# Altium project toetsenbord.PrjPcb
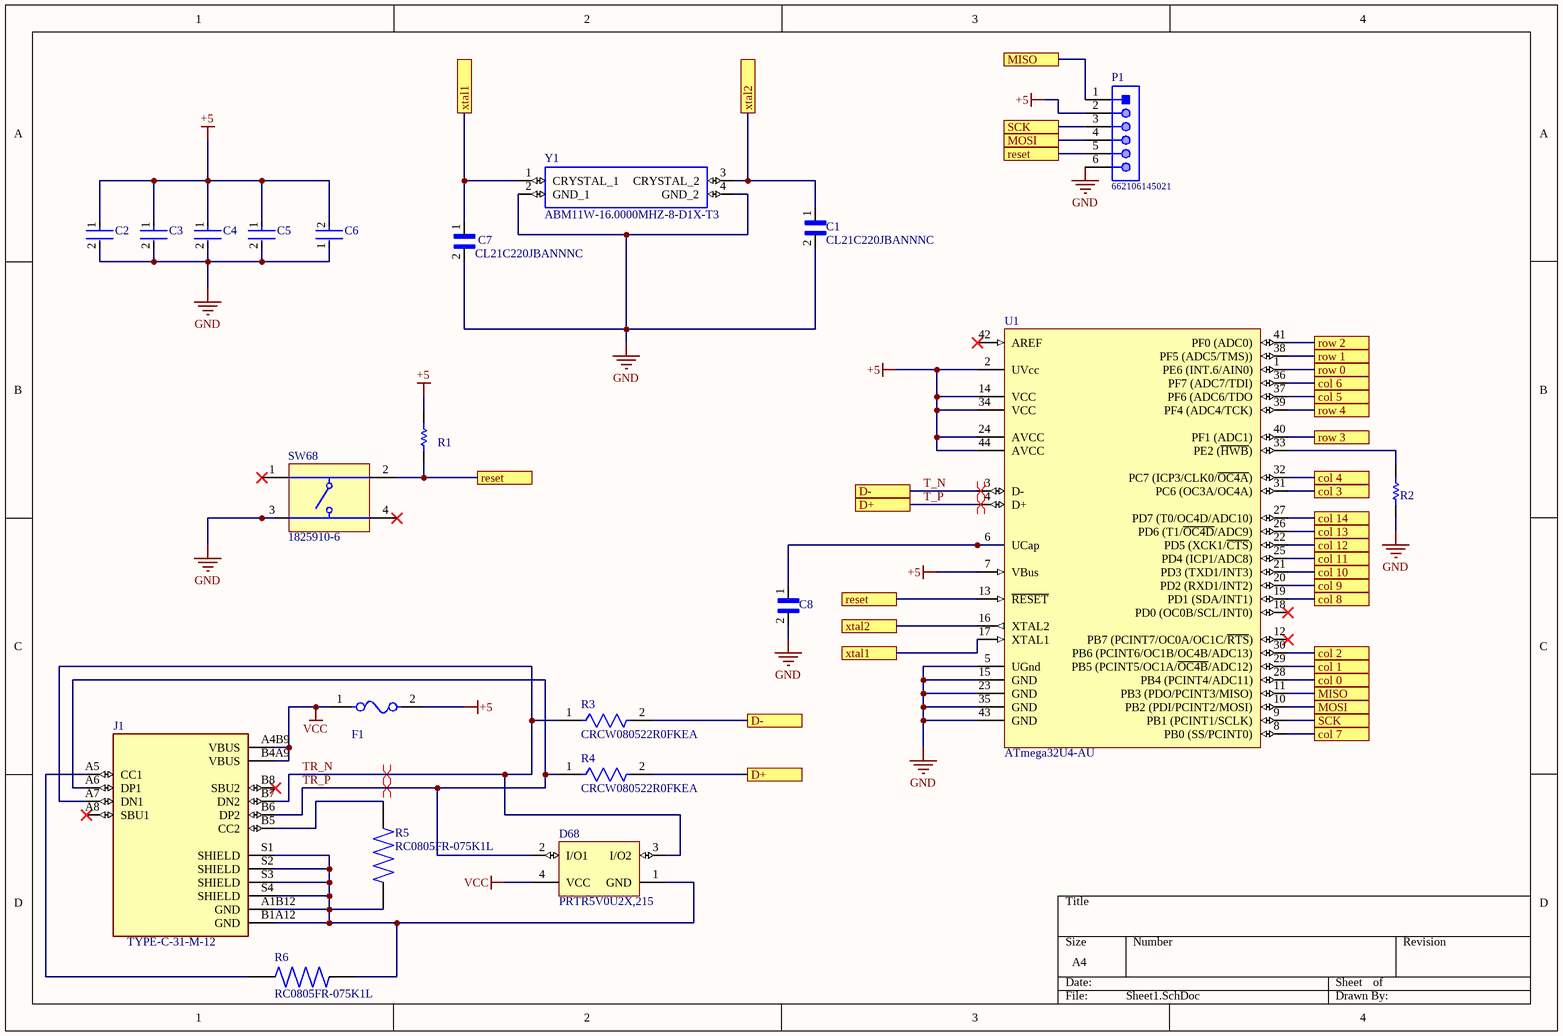
[diagram p0: Sheet1.SchDoc]
2 sheets, 155 parts. Net scope: flat (ports and power ports of the same name join across sheets).
Board file: PCB1.PcbDoc
Sheets:
  Sheet1.SchDoc
  switch matrix.SchDoc

## Sheet Sheet1.SchDoc
size A4; SheetNumber: 1; SheetTotal: 2

### Parts
C1  CL21C220JBANNNC  [CAPC2012X140N]
C2  (no value)  [FP-CL21-IPC_C]
C3  (no value)  [FP-CL21-IPC_C]
C4  (no value)  [FP-CL21-IPC_C]
C5  (no value)  [FP-CL21-IPC_C]
C6  (no value)  [FP-CL21B106KOQNNNE-MFG]
C7  CL21C220JBANNNC  [CAPC2012X140N]
C8  CL21B105KAFNNNE  [CAPC2012X140N]  (value not drawn)
D68  PRTR5V0U2X,215  [NXP-SOT143B-4_V]
F1  Fuse_Bel_0ZCJ0025AF2E_eec  [Bel_3216_0]  (value not drawn)
J1  TYPE-C-31-M-12  [HRO_TYPE-C-31-M-12]
P1  662106145021  [662106145021]
R1  RC0805FR-0710KL  [RESC2013X60X35NL10T20]  (value not drawn)
R2  RC0805FR-0710KL  [RESC2013X60X35NL10T20]  (value not drawn)
R3  CRCW080522R0FKEA  [FP-CRCW0805-e3-IPC_C]
R4  CRCW080522R0FKEA  [FP-CRCW0805-e3-IPC_C]
R5  RC0805FR-075K1L  [RESC2012X60N]
R6  RC0805FR-075K1L  [RESC2012X60N]
SW68  1825910-6  [TECO-1825910-6_V]
U1  ATmega32U4-AU  [44ML_M]
Y1  ABM11W-16.0000MHZ-8-D1X-T3  [ABM11W300000MHZ4B1UT3]

### Ports
col 0, col 1, col 2, col 3, col 4, col 5, col 6, col 7, col 8, col 9, col 10, col 11, col 12, col 13, col 14, D+, D-, MISO, MOSI, reset, row 0, row 1, row 2, row 3, row 4, SCK, xtal1, xtal2

### Nets
+5: C2.1 C3.1 C4.1 C5.1 C6.2 F1.2 P1.2 R1.2 U1.2(UVcc) U1.7(VBus) U1.14(VCC) U1.24(AVCC) U1.34(VCC) U1.44(AVCC)
GND: C1.2 C2.2 C3.2 C4.2 C5.2 C6.1 C7.2 C8.2 P1.6 R2.1 SW68.3 U1.5(UGnd) U1.15(GND) U1.23(GND) U1.35(GND) U1.43(GND) Y1.2(GND_1) Y1.4(GND_2)
VCC: D68.4(VCC) F1.1 J1.A4B9(VBUS) J1.B4A9(VBUS)
T_N: R3.2 U1.3(D-) ; port D-
T_P: R4.2 U1.4(D+) ; port D+
TR_N: D68.3(I/O2) J1.A7(DN1) J1.B7(DN2) R3.1
TR_P: D68.2(I/O1) J1.A6(DP1) J1.B6(DP2) R4.1
NetC1_1: C1.1 U1.16(XTAL2) Y1.3(CRYSTAL_2) ; port xtal2
NetC7_1: C7.1 U1.17(XTAL1) Y1.1(CRYSTAL_1) ; port xtal1
NetC8_1: C8.1 U1.6(UCap)
NetD1_1: U1.1(PE6_(INT.6/AIN0)) ; port row 0
NetD16_1: U1.38(PF5_(ADC5/TMS))) ; port row 1
NetD31_1: U1.41(PF0_(ADC0)) ; port row 2
NetD45_1: U1.40(PF1_(ADC1)) ; port row 3
NetD59_1: U1.39(PF4_(ADC4/TCK)) ; port row 4
NetD68_1: D68.1(GND) J1.A1B12(GND) J1.B1A12(GND) J1.S1(SHIELD) J1.S2(SHIELD) J1.S3(SHIELD) J1.S4(SHIELD) R5.1 R6.2
NetJ1_A5: J1.A5(CC1) R6.1
NetJ1_B5: J1.B5(CC2) R5.2
NetP1_1: P1.1 U1.11(PB3_(PDO/PCINT3/MISO)) ; port MISO
NetP1_3: P1.3 U1.9(PB1_(PCINT1/SCLK)) ; port SCK
NetP1_4: P1.4 U1.10(PB2_(PDI/PCINT2/MOSI)) ; port MOSI
NetP1_5: P1.5 R1.1 SW68.2 U1.13(~{RESET}) ; port reset
NetR2_2: R2.2 U1.33(PE2_(~{HWB}))
NetSW1_2: U1.28(PB4_(PCINT4/ADC11)) ; port col 0
NetSW2_2: U1.29(PB5_(PCINT5/OC1A/~{OC4B}/ADC12)) ; port col 1
NetSW3_2: U1.30(PB6_(PCINT6/OC1B/OC4B/ADC13)) ; port col 2
NetSW4_2: U1.31(PC6_(OC3A/OC4A)) ; port col 3
NetSW5_2: U1.32(PC7_(ICP3/CLK0/~{OC4A})) ; port col 4
NetSW6_2: U1.37(PF6_(ADC6/TDO) ; port col 5
NetSW7_2: U1.36(PF7_(ADC7/TDI)) ; port col 6
NetSW8_2: U1.8(PB0_(SS/PCINT0)) ; port col 7
NetSW9_2: U1.19(PD1_(SDA/INT1)) ; port col 8
NetSW10_2: U1.20(PD2_(RXD1/INT2)) ; port col 9
NetSW11_2: U1.21(PD3_(TXD1/INT3)) ; port col 10
NetSW12_2: U1.25(PD4_(ICP1/ADC8)) ; port col 11
NetSW13_2: U1.22(PD5_(XCK1/~{CTS})) ; port col 12
NetSW14_2: U1.26(PD6_(T1/~{OC4D}/ADC9)) ; port col 13
NetSW15_2: U1.27(PD7_(T0/OC4D/ADC10)) ; port col 14

Not connected (* = marked no-connect by the designer): J1 A8(SBU1)* B8(SBU2)*; SW68 1* 4*; U1 12(PB7_(PCINT7/OC0A/OC1C/~{RTS}))* 18(PD0_(OC0B/SCL/INT0))* 42(AREF)*

### Layout directives
differential pair: T_N, T_P, TR_N, TR_P

### Library data of the parts
C1 C7 = CL21C220JBANNNC: 22pF Â±5% 50V Ceramic Capacitor C0G, NP0 0805 _2012 Metric_; MF: Samsung; Value: *; Price: None; Package: 0805 Samsung; SnapEDA_Link: https://www.snapeda.com/parts/CL21C220JBANNNC/Samsung%20Electro-Mechanics/view-part/514319/?ref=snap; Availability: Unavailable; MP: CL21C220JBANNNC
C2-C5 = CMP-2000-05017-2: CL21 Series 0805 100nF 50V ±10% Tolerance X7R Multilayer Ceramic Chip Capacitor; Depth: 1.25mm; Height: 0.85mm; Width: 0.049inch; Tolerance: 10%; Case Code (Metric): 2012; Case Code (Imperial): 0805; Material: Ceramic; Thickness: 0.037inch; Min Operating Temperature: -55°C; Contact Plating: Tin; Length: 2mm; Mount: Surface Mount; Voltage Rating (DC): 50V; Lead Free: Lead Free; Dielectric: X7R; Radiation Hardening: No; Capacitance: 100nF; Voltage Rating: 50V; Case/Package: 0805; Packaging: Tape and Reel; Max Operating Temperature: 125°C; Voltage: 50V
C6 = CMP-2000-06106-2: CAP CER 10UF 16V X7R 0805; Manufacturer Part Number: CL21B106KOQNNNE; Manufacturer: Samsung Electro-Mechanics America, Inc; Material: Ceramic; Tolerance: 10%; Temperature Coefficient: 15%; Digikey Description: CAP CER 10UF 16V X7R 0805; Lead Free: Yes; ComponentLink2URL: http://www.samsungsem.com/servlet/FileDownload?path=productsearch&sname=CL21B106KOQNNNE.pdf&oname=CL21B106KOQNNNE.pdf; ComponentLink2Description: Datasheet; Temperature Range Low: -55°C; RoHS: TRUE; Category: Cap; Temperature Characteristic: X7R; Automotive: No; Octopart: https://octopart.com/cl21b106koqnnne-samsung-19832289; Device Class L3: Ceramic Capacitors; Temperature Range High: +125°C; Height: 1.4mm; Device Class L2: Capacitors; Voltage Rating: 16V; Value: 10uF; Temperature: -55°C to +125°C; Device Class L1: Passive Components; Ipc Land Pattern Name: CAPC200125X125; Package: CL21B106KOQNNNE; Capacitance: 10uF
C8 = CL21B105KAFNNNE: 1ÂµF Â±10% 25V Ceramic Capacitor X7R 0805 (2012 Metric); MF: Samsung Electro-Mechanics; SnapEDA_Link: https://www.snapeda.com/parts/CL21B105KAFNNNE/Samsung%20Electro-Mechanics/view-part/544120/?ref=snap; Arrow_Electronics-Purchase-URL: https://snapeda.com/shop?store=Arrow+Electronics&id=544120; Arrow_Europe-Purchase-URL: https://snapeda.com/shop?store=Arrow+Europe&id=544120; MP: CL21B105KAFNNNE; Package: 0805 Samsung; DigiKey-Purchase-URL: https://snapeda.com/shop?store=DigiKey&id=544120; Digi-Key_Part_Number: 1276-1066-1-ND; Value: *; Check_prices: https://www.snapeda.com/parts/CL21B105KAFNNNE/Samsung%20Electro-Mechanics/view-part/544120/?ref=eda
D68 = CMP-2000-05285-1: Ultra Low Capacitance Double Rail-to-Rail ESD Protection Diode, 5.5 V, 1 pF, -40 to 85 degC, 4-Pin SOT143B, RoHS, Tape and Reel; Manufacturer: NXP Semiconductors; Capacitance Value: 16pF; Number of Elements: 1; Rad Hardened: No; Reverse Breakdown Voltage: 6V; Working Voltage (Max): 5.5V; Polarity: Uni-Directional; Configuration: Quad; Leakage Current: 0.1uA; Product Height (mm): 1mm; Suppressor Type: DiodeArrays; Product Length (mm): 3mm; Product Depth (mm): 1.4mm; ESD Protection Voltage: 8KV@ContactDisc; Package Type: SOT; Mounting: SurfaceMount; Packaging: TapeandReel; Datasheet Version: Rev. 02, 01/2008; Reverse Stand-off Voltage: 5.5V; Manufacturer URL: http://www.nxp.com/; Operating Temp Range: -40Cto85C; Operating Temperature Classification: Industrial; Working Voltage: 5.5V; Operating Temperature Min Deg. C: -40C; Datasheet URL: https://datasheet.ciiva.com/4479/prtr5v0u2x-102853-4479461.pdf; Leakage Current (Max): 0.1uA; Direction Type: Uni-Directional; Pin Count: 3+Tab; Operating Temperature Max Deg. C: 85C; Mounting Style: SurfaceMount; Package / Case: SOT
F1 = Fuse_Bel_0ZCJ0025AF2E_eec: FUSE PTC RESET FUSE 24V 250MA 1206; Manufacturer: Bel; Mfg Package Ident: 3216; Part Number: 0ZCJ0025AF2E; helpURL: https://upverter.com/upn/revision/1ff9a5fd39562549/; ComponentLink2Description: Datasheet; Temperature: -40°C to +85°C; Package: 3216; Supplier 2: Mouser; Price: 0.0950423728797; Supplier 1: Digi-Key; ComponentLink1URL: https://upverter.com/upn/revision/1ff9a5fd39562549/; Supplier Part Number 2: 530-0ZCJ0025AF2E; Supplier Part Number 1: 507-1799-1-ND; Voltage: 24V; ComponentLink1Description: Upverter; ComponentLink2URL: https://www.belfuse.com/resources/CircuitProtection/datasheets/0ZCJ%20Nov2016.pdf; RoHS: TRUE; Mouser Part Number: 530-0ZCJ0025AF2E; Temperature Range High: +85°C; Digikey Description: FUSE PTC RESET FUSE 24V 250MA 1206; Digikey Part Number: 507-1799-1-ND; Lead Free: yes; Temperature Range Low: -40°C
J1 = TYPE-C-31-M-12: USB Connectors 24 Receptacle 1 8.94*7.3mm RoHS; MF: HRO Electronics Co., Ltd.; Value: *; SnapEDA_Link: https://www.snapeda.com/parts/TYPE-C-31-M-12/HRO%20Electronics%20Co.,%20Ltd./view-part/3228496/?ref=snap; Package: Package; MP: TYPE-C-31-M-12; Price: None; Availability: Unavailable
P1 = CMP-1502-00486-1: SMT Male Header WR-MPC3, with SMT Solder Tabs, Right Angled, Single Row, pitch 3 mm, 6 pins; Manufacturer: Wurth Elektronik; Pin Number: 6; Working Voltage: 250VAC; Pitch: 3mm; Contact Resistance: 10mOhm; Orientation: RightAngled; Publisher: WurthElektronik; Gender: Male; Mounting Technology: SMT; Datasheet URL: https://katalog.we-online.de/em/datasheet/6621xx145021.pdf; Manufacturer URL: http://www.we-online.de; Package Reference: 662106145021; Operating Temperature: -40to105degC; Part Number: 662106145021; Packaging: TapeandReel
R1 R2 = CMP-1659-00013-4: Chip Resistor, 10 KOhm, +/- 1%, 0.125 W, -55 to 155 degC, 0805 (2012 Metric), RoHS, Tape and Reel; Manufacturer: Yageo; Voltage Rating: 150 V; Mount: Surface Mount; ComponentLink1Description: Manufacturer URL; ComponentLink2URL: http://www.yageo.com/documents/recent/PYu-RC_Group_51_RoHS_L_04.pdf; Pins: 2; Length: 2 mm; Min Operating Temperature: -55 degC; Height: 0.5 mm; Mounting Technology: Surface Mount; RoHSCompliant: true; REACH SVHC: No SVHC; ComponentLink1URL: http://www.yageo.com/; Max Operating Temperature: 155 degC; PackageReference: 0805; DatasheetVersion: Rev. 4, 02/2016; Package Quantity: 5000; Packaging: Tape and Reel; ComponentLink2Description: Datasheet; PackageDescription: 2-Pin Surface Mounted Device, Body 2 x 1.25 mm
R3 R4 = CMP-2001-03692-2: RES Thick Film, 22Ω, 1%, 0.125W, 100ppm/°C, 0805; Resistance: 22R; Power Rating: 125mW; Voltage Rating: 150V; Case/Package: 0805; Radiation Hardening: No; Number of Terminations: 2; Termination: SMD/SMT; Package Quantity: 5000; Weight: 0.000194oz; Mount: Surface Mount; Lead Free: Lead Free; Height: 0.45mm; Composition: Thick Film; Min Operating Temperature: -55°C; Case Code (Metric): 2012; Temperature Coefficient: 100ppm/°C; Depth: 1.25mm; Packaging: Tape and Reel; Contact Plating: Tin; Width: 1.25mm; Case Code (Imperial): 0805; Length: 2mm; Max Operating Temperature: 155°C; Tolerance: 1%; Features: Automotive AEC-Q200; Military Standard: Not; Voltage Rating (DC): 150V; Max Power Dissipation: 125mW
R5 R6 = RC0805FR-075K1L: Resistor: thick film; SMD; 0805; 5.1kÎ©; 0.125W; Â±1%; -55Ã·155Â°C; Package: None; Price: None; Value: *; MP: RC0805FR-075K1L; Availability: Unavailable
SW68 = CMP-1684-00021-1: Tact Switch, SPST-NO, 0.05 A, -35 to 85 degC, 4-Pin THD, RoHS, Bulk; Manufacturer: TE Connectivity; Maximum Contact Resistance: 100mOhm; Mechanical Life: 100000Cycles; Bushing Type: Unthreaded; Switch Configuration: OFF(ON); Maximum DC Voltage Rating: 24V; Contact Rating @ Voltage: 0.05A@24VDC; Actuator Color: Black; Body Orientation: Straight; Function: MomentaryContact; Illumination: N/R; Actuator Style: RoundButton; Actuator Material: PolybutyleneTerephthalate; Dielectric Strength: 500VAC; Pole Throw Configuration: SPST; Actuator Length: 1.4mm; Product Weight: N/A; Contact Material: CopperAlloy; Housing Material: N/A; Terminal Type: PCPins; Minimum Insulation Resistance: 100MOhm; Package Description: 4-Pin Through Hole Device, Body 5.99 x 5.99 mm, Pitch 6.5 mm; Part No: 1825910-6; Package Reference: THD; Base Material: N/A; Manufacturer URL: http://www.te.com; Contact Plating: Silver; RoHS: Yes; Datasheet Version: Rev. C9; Electrical Life: 100000Cycles; Maximum AC Voltage Rating: N/A; Thread Size: N/R; Operating Temperature: -35to85C; Mounting: ThroughHole; Dimension: 5.99x5mm; Datasheet URL: http://www.te.com/commerce/DocumentDelivery/DDEController?Action=showdoc&DocId=Customer+Drawing%7F1825910%7FC9%7Fpdf%7FEnglish%7FENG_CD_1825910_C9.pdf%7F1825910-6; Family: 1825910; Seal Location: N/A; Seal Description: N/A; Packaging: N/A
U1 = CMP-0095-00285-2: 8-bit AVR Microcontroller, 2.7-5.5V, 16MHz, 32KB Flash, 1KB EEPROM, 2.5KB SRAM, USB Controller, 44-pin TQFP, Industrial Grade (-40°C to 85°C), Ext Osc; RevisionNote: DatasheetVersion updated. URLs added.; ComponentLink1Description: Manufacturer URL; PackageDescription: 44-Pin Plastic Thin Quad Flat Pack, 10 x 10 x 1.0 mm Body, 0.8 mm Pitch (TQFP); DatasheetVersion: revF, Nov-2010; ComponentLink2URL: http://www.atmel.com/dyn/resources/prod_documents/doc7766.pdf; ComponentLink1URL: http://www.atmel.com/; PackageReference: 44ML; ComponentLink2Description: ATmega16U4/32U4 Datasheet; PackageVersion: rev.G, Jul-2007; ComponentLink3URL: http://www.atmel.com/dyn/resources/prod_documents/7766S.pdf; ComponentLink3Description: ATmega16U4 ATmega32U4 Summary
Y1 = ABM11W-16.0000MHZ-8-D1X-T3: 16MHz Â±10ppm Crystal 8pF 200 Ohms 4-SMD, No Lead; MF: Abracon; SnapEDA_Link: https://www.snapeda.com/parts/ABM11W-16.0000MHZ-8-D1X-T3/Abracon/view-part/2583382/?ref=snap; Mouser-Purchase-URL: https://snapeda.com/shop?store=Mouser&id=2583382; Availability: Warning; Value: *; Package: SMD-4 Abracon; MP: ABM11W-16.0000MHZ-8-D1X-T3; Price: None; BuyPart: https://www.snapeda.com/parts/ABM11W-16.0000MHZ-8-D1X-T3/Abracon/view-part/2583382/?ref=eda

## Sheet switch matrix.SchDoc
size 584 x 241 mm; SheetNumber: 2; SheetTotal: 2
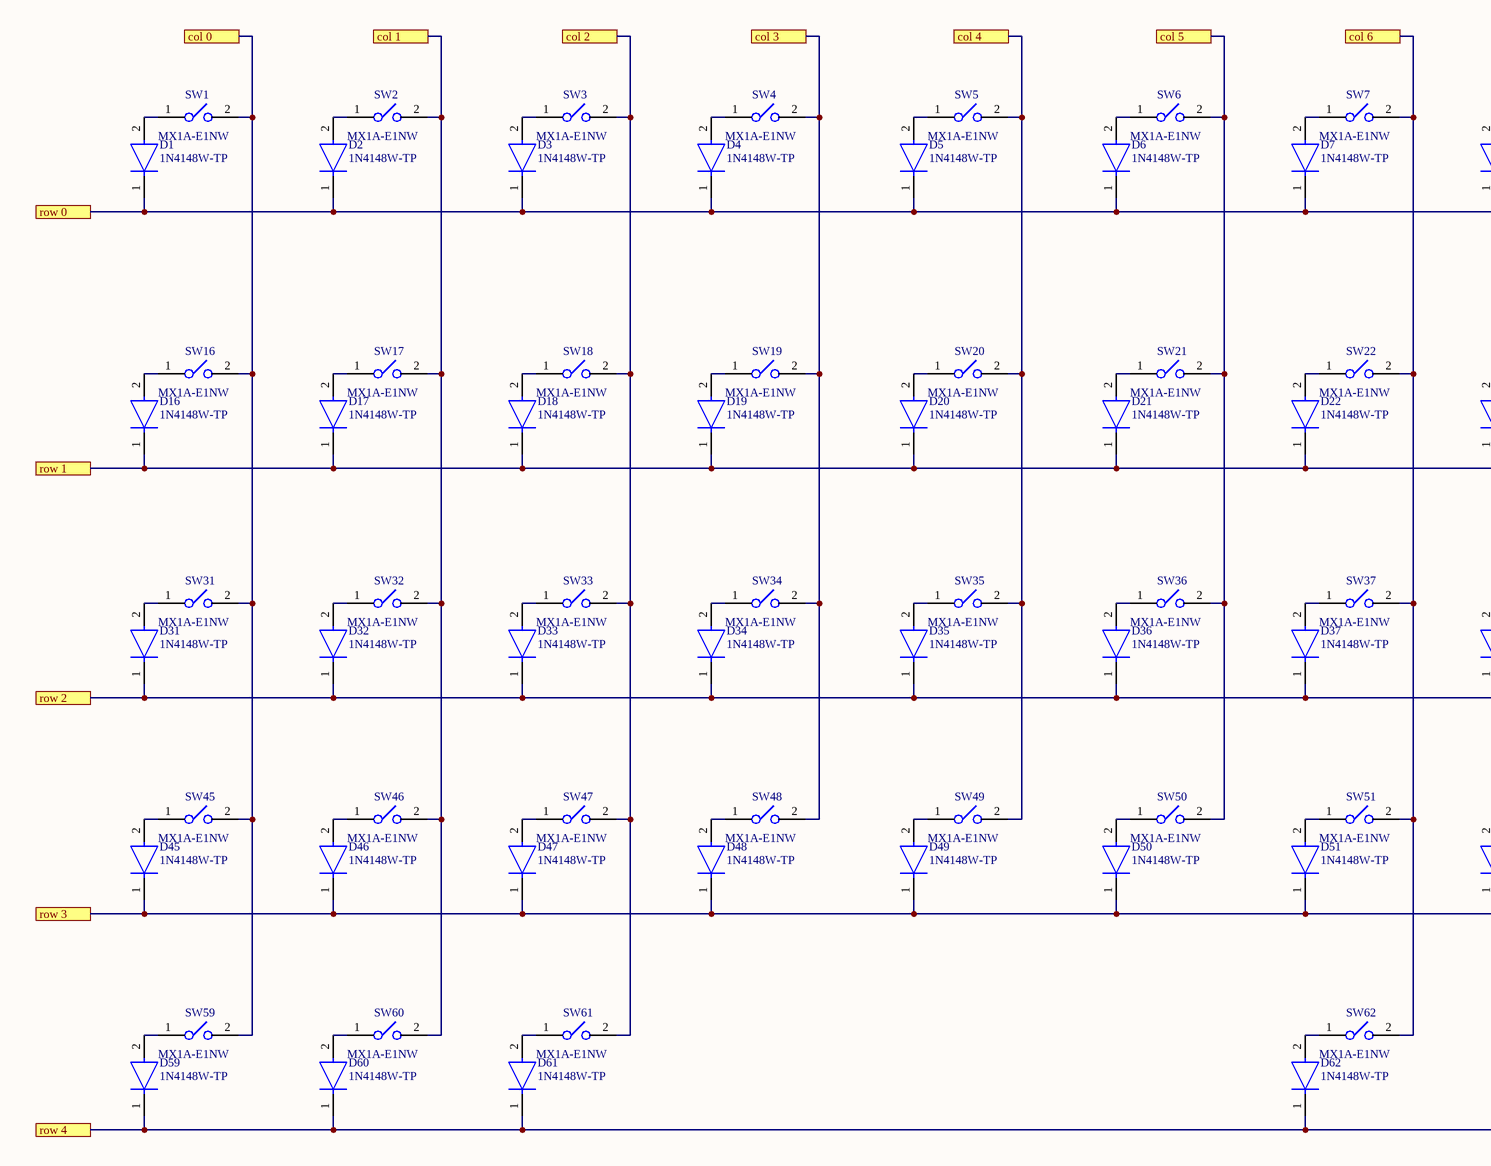
[diagram p1: switch matrix.SchDoc, left]
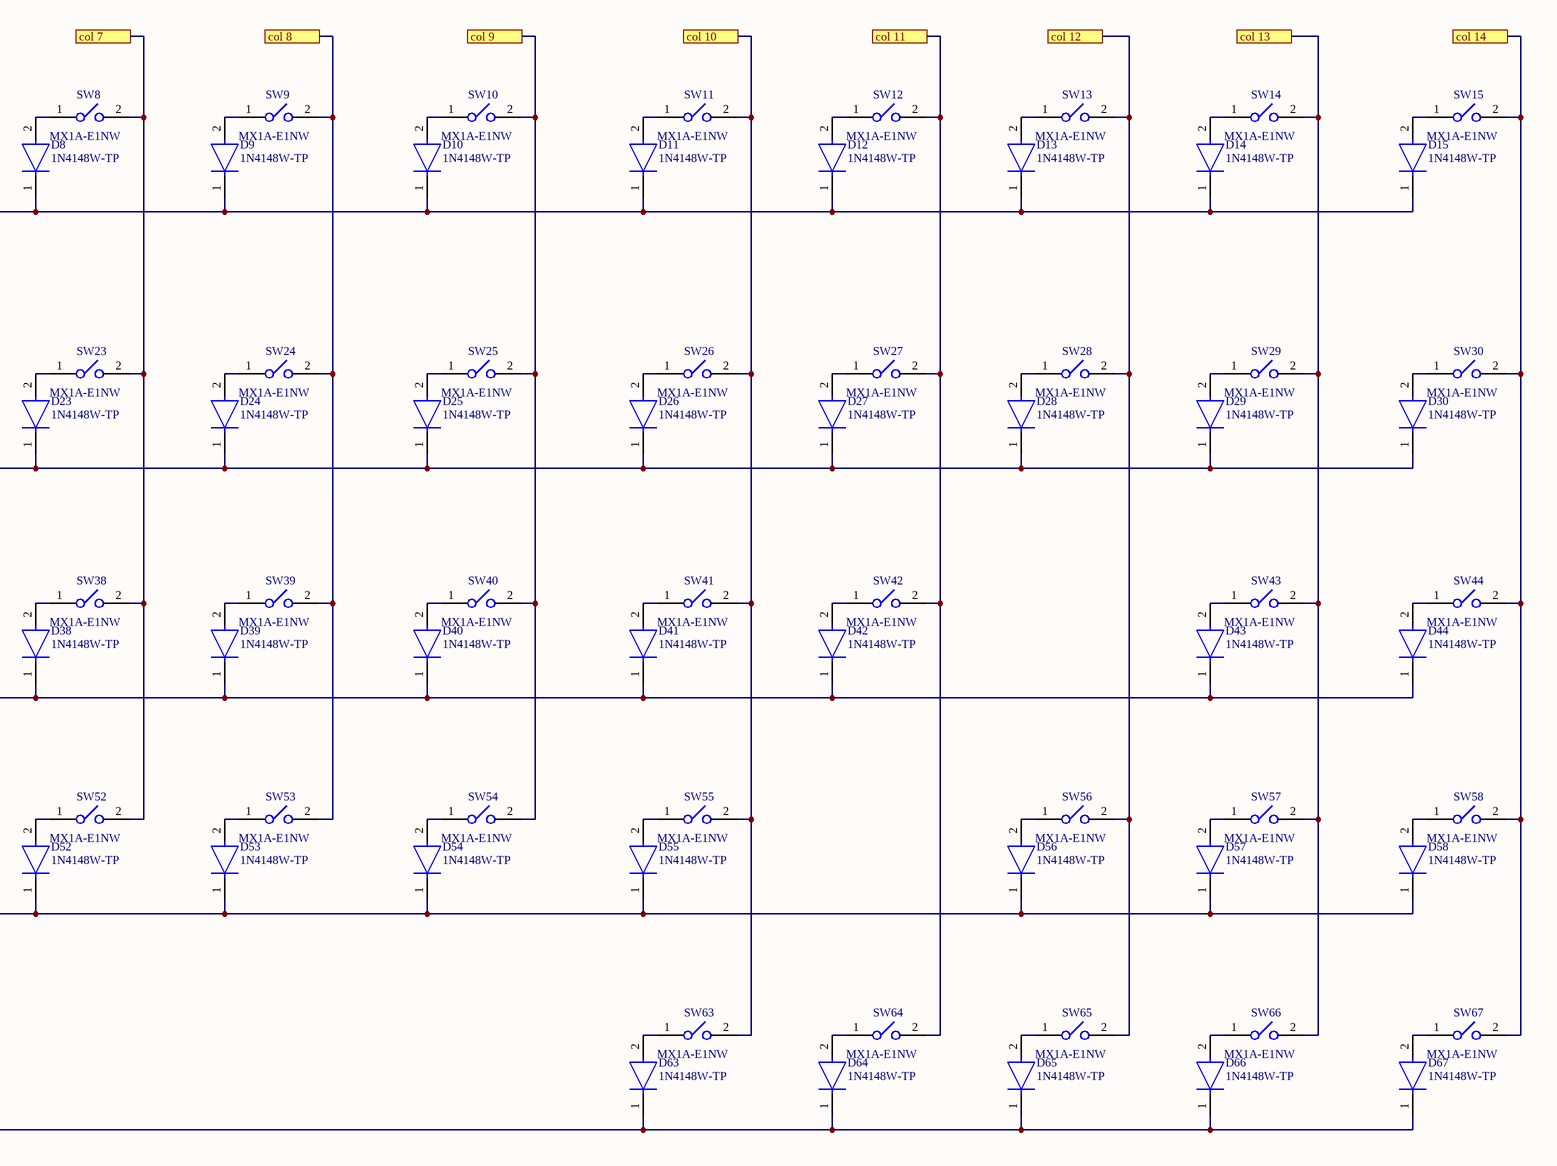
[diagram p2: switch matrix.SchDoc, right]

### Parts
D1  1N4148W-TP  [FP-SOD-123-IPC_A]
D2  1N4148W-TP  [FP-SOD-123-IPC_A]
D3  1N4148W-TP  [FP-SOD-123-IPC_A]
D4  1N4148W-TP  [FP-SOD-123-IPC_A]
D5  1N4148W-TP  [FP-SOD-123-IPC_A]
D6  1N4148W-TP  [FP-SOD-123-IPC_A]
D7  1N4148W-TP  [FP-SOD-123-IPC_A]
D8  1N4148W-TP  [FP-SOD-123-IPC_A]
D9  1N4148W-TP  [FP-SOD-123-IPC_A]
D10  1N4148W-TP  [FP-SOD-123-IPC_A]
D11  1N4148W-TP  [FP-SOD-123-IPC_A]
D12  1N4148W-TP  [FP-SOD-123-IPC_A]
D13  1N4148W-TP  [FP-SOD-123-IPC_A]
D14  1N4148W-TP  [FP-SOD-123-IPC_A]
D15  1N4148W-TP  [FP-SOD-123-IPC_A]
D16  1N4148W-TP  [FP-SOD-123-IPC_A]
D17  1N4148W-TP  [FP-SOD-123-IPC_A]
D18  1N4148W-TP  [FP-SOD-123-IPC_A]
D19  1N4148W-TP  [FP-SOD-123-IPC_A]
D20  1N4148W-TP  [FP-SOD-123-IPC_A]
D21  1N4148W-TP  [FP-SOD-123-IPC_A]
D22  1N4148W-TP  [FP-SOD-123-IPC_A]
D23  1N4148W-TP  [FP-SOD-123-IPC_A]
D24  1N4148W-TP  [FP-SOD-123-IPC_A]
D25  1N4148W-TP  [FP-SOD-123-IPC_A]
D26  1N4148W-TP  [FP-SOD-123-IPC_A]
D27  1N4148W-TP  [FP-SOD-123-IPC_A]
D28  1N4148W-TP  [FP-SOD-123-IPC_A]
D29  1N4148W-TP  [FP-SOD-123-IPC_A]
D30  1N4148W-TP  [FP-SOD-123-IPC_A]
D31  1N4148W-TP  [FP-SOD-123-IPC_A]
D32  1N4148W-TP  [FP-SOD-123-IPC_A]
D33  1N4148W-TP  [FP-SOD-123-IPC_A]
D34  1N4148W-TP  [FP-SOD-123-IPC_A]
D35  1N4148W-TP  [FP-SOD-123-IPC_A]
D36  1N4148W-TP  [FP-SOD-123-IPC_A]
D37  1N4148W-TP  [FP-SOD-123-IPC_A]
D38  1N4148W-TP  [FP-SOD-123-IPC_A]
D39  1N4148W-TP  [FP-SOD-123-IPC_A]
D40  1N4148W-TP  [FP-SOD-123-IPC_A]
D41  1N4148W-TP  [FP-SOD-123-IPC_A]
D42  1N4148W-TP  [FP-SOD-123-IPC_A]
D43  1N4148W-TP  [FP-SOD-123-IPC_A]
D44  1N4148W-TP  [FP-SOD-123-IPC_A]
D45  1N4148W-TP  [FP-SOD-123-IPC_A]
D46  1N4148W-TP  [FP-SOD-123-IPC_A]
D47  1N4148W-TP  [FP-SOD-123-IPC_A]
D48  1N4148W-TP  [FP-SOD-123-IPC_A]
D49  1N4148W-TP  [FP-SOD-123-IPC_A]
D50  1N4148W-TP  [FP-SOD-123-IPC_A]
D51  1N4148W-TP  [FP-SOD-123-IPC_A]
D52  1N4148W-TP  [FP-SOD-123-IPC_A]
D53  1N4148W-TP  [FP-SOD-123-IPC_A]
D54  1N4148W-TP  [FP-SOD-123-IPC_A]
D55  1N4148W-TP  [FP-SOD-123-IPC_A]
D56  1N4148W-TP  [FP-SOD-123-IPC_A]
D57  1N4148W-TP  [FP-SOD-123-IPC_A]
D58  1N4148W-TP  [FP-SOD-123-IPC_A]
D59  1N4148W-TP  [FP-SOD-123-IPC_A]
D60  1N4148W-TP  [FP-SOD-123-IPC_A]
D61  1N4148W-TP  [FP-SOD-123-IPC_A]
D62  1N4148W-TP  [FP-SOD-123-IPC_A]
D63  1N4148W-TP  [FP-SOD-123-IPC_A]
D64  1N4148W-TP  [FP-SOD-123-IPC_A]
D65  1N4148W-TP  [FP-SOD-123-IPC_A]
D66  1N4148W-TP  [FP-SOD-123-IPC_A]
D67  1N4148W-TP  [FP-SOD-123-IPC_A]
SW1  Part Number: MX1A-E1NW  [SW_Cherry_MX_1.00u_PCB]  (hidden comment: Switch_Key_Switch_MX1A-E1NW_eec)
SW2  Part Number: MX1A-E1NW  [SW_Cherry_MX_1.00u_PCB]  (hidden comment: Switch_Key_Switch_MX1A-E1NW_eec)
SW3  Part Number: MX1A-E1NW  [SW_Cherry_MX_1.00u_PCB]  (hidden comment: Switch_Key_Switch_MX1A-E1NW_eec)
SW4  Part Number: MX1A-E1NW  [SW_Cherry_MX_1.00u_PCB]  (hidden comment: Switch_Key_Switch_MX1A-E1NW_eec)
SW5  Part Number: MX1A-E1NW  [SW_Cherry_MX_1.00u_PCB]  (hidden comment: Switch_Key_Switch_MX1A-E1NW_eec)
SW6  Part Number: MX1A-E1NW  [SW_Cherry_MX_1.00u_PCB]  (hidden comment: Switch_Key_Switch_MX1A-E1NW_eec)
SW7  Part Number: MX1A-E1NW  [SW_Cherry_MX_1.00u_PCB]  (hidden comment: Switch_Key_Switch_MX1A-E1NW_eec)
SW8  Part Number: MX1A-E1NW  [SW_Cherry_MX_1.00u_PCB]  (hidden comment: Switch_Key_Switch_MX1A-E1NW_eec)
SW9  Part Number: MX1A-E1NW  [SW_Cherry_MX_1.00u_PCB]  (hidden comment: Switch_Key_Switch_MX1A-E1NW_eec)
SW10  Part Number: MX1A-E1NW  [SW_Cherry_MX_1.00u_PCB]  (hidden comment: Switch_Key_Switch_MX1A-E1NW_eec)
SW11  Part Number: MX1A-E1NW  [SW_Cherry_MX_1.00u_PCB]  (hidden comment: Switch_Key_Switch_MX1A-E1NW_eec)
SW12  Part Number: MX1A-E1NW  [SW_Cherry_MX_1.00u_PCB]  (hidden comment: Switch_Key_Switch_MX1A-E1NW_eec)
SW13  Part Number: MX1A-E1NW  [SW_Cherry_MX_1.00u_PCB]  (hidden comment: Switch_Key_Switch_MX1A-E1NW_eec)
SW14  Part Number: MX1A-E1NW  [SW_Cherry_MX_2.00u_PCB]  (hidden comment: Switch_Key_Switch_MX1A-E1NW_eec)
SW15  Part Number: MX1A-E1NW  [SW_Cherry_MX_1.00u_PCB]  (hidden comment: Switch_Key_Switch_MX1A-E1NW_eec)
SW16  Part Number: MX1A-E1NW  [SW_Cherry_MX_1.50u_PCB]  (hidden comment: Switch_Key_Switch_MX1A-E1NW_eec)
SW17  Part Number: MX1A-E1NW  [SW_Cherry_MX_1.00u_PCB]  (hidden comment: Switch_Key_Switch_MX1A-E1NW_eec)
SW18  Part Number: MX1A-E1NW  [SW_Cherry_MX_1.00u_PCB]  (hidden comment: Switch_Key_Switch_MX1A-E1NW_eec)
SW19  Part Number: MX1A-E1NW  [SW_Cherry_MX_1.00u_PCB]  (hidden comment: Switch_Key_Switch_MX1A-E1NW_eec)
SW20  Part Number: MX1A-E1NW  [SW_Cherry_MX_1.00u_PCB]  (hidden comment: Switch_Key_Switch_MX1A-E1NW_eec)
SW21  Part Number: MX1A-E1NW  [SW_Cherry_MX_1.00u_PCB]  (hidden comment: Switch_Key_Switch_MX1A-E1NW_eec)
SW22  Part Number: MX1A-E1NW  [SW_Cherry_MX_1.00u_PCB]  (hidden comment: Switch_Key_Switch_MX1A-E1NW_eec)
SW23  Part Number: MX1A-E1NW  [SW_Cherry_MX_1.00u_PCB]  (hidden comment: Switch_Key_Switch_MX1A-E1NW_eec)
SW24  Part Number: MX1A-E1NW  [SW_Cherry_MX_1.00u_PCB]  (hidden comment: Switch_Key_Switch_MX1A-E1NW_eec)
SW25  Part Number: MX1A-E1NW  [SW_Cherry_MX_1.00u_PCB]  (hidden comment: Switch_Key_Switch_MX1A-E1NW_eec)
SW26  Part Number: MX1A-E1NW  [SW_Cherry_MX_1.00u_PCB]  (hidden comment: Switch_Key_Switch_MX1A-E1NW_eec)
SW27  Part Number: MX1A-E1NW  [SW_Cherry_MX_1.00u_PCB]  (hidden comment: Switch_Key_Switch_MX1A-E1NW_eec)
SW28  Part Number: MX1A-E1NW  [SW_Cherry_MX_1.00u_PCB]  (hidden comment: Switch_Key_Switch_MX1A-E1NW_eec)
SW29  Part Number: MX1A-E1NW  [SW_Cherry_MX_1.50u_PCB]  (hidden comment: Switch_Key_Switch_MX1A-E1NW_eec)
SW30  Part Number: MX1A-E1NW  [SW_Cherry_MX_1.00u_PCB]  (hidden comment: Switch_Key_Switch_MX1A-E1NW_eec)
SW31  Part Number: MX1A-E1NW  [SW_Cherry_MX_1.75u_PCB]  (hidden comment: Switch_Key_Switch_MX1A-E1NW_eec)
SW32  Part Number: MX1A-E1NW  [SW_Cherry_MX_1.00u_PCB]  (hidden comment: Switch_Key_Switch_MX1A-E1NW_eec)
SW33  Part Number: MX1A-E1NW  [SW_Cherry_MX_1.00u_PCB]  (hidden comment: Switch_Key_Switch_MX1A-E1NW_eec)
SW34  Part Number: MX1A-E1NW  [SW_Cherry_MX_1.00u_PCB]  (hidden comment: Switch_Key_Switch_MX1A-E1NW_eec)
SW35  Part Number: MX1A-E1NW  [SW_Cherry_MX_1.00u_PCB]  (hidden comment: Switch_Key_Switch_MX1A-E1NW_eec)
SW36  Part Number: MX1A-E1NW  [SW_Cherry_MX_1.00u_PCB]  (hidden comment: Switch_Key_Switch_MX1A-E1NW_eec)
SW37  Part Number: MX1A-E1NW  [SW_Cherry_MX_1.00u_PCB]  (hidden comment: Switch_Key_Switch_MX1A-E1NW_eec)
SW38  Part Number: MX1A-E1NW  [SW_Cherry_MX_1.00u_PCB]  (hidden comment: Switch_Key_Switch_MX1A-E1NW_eec)
SW39  Part Number: MX1A-E1NW  [SW_Cherry_MX_1.00u_PCB]  (hidden comment: Switch_Key_Switch_MX1A-E1NW_eec)
SW40  Part Number: MX1A-E1NW  [SW_Cherry_MX_1.00u_PCB]  (hidden comment: Switch_Key_Switch_MX1A-E1NW_eec)
SW41  Part Number: MX1A-E1NW  [SW_Cherry_MX_1.00u_PCB]  (hidden comment: Switch_Key_Switch_MX1A-E1NW_eec)
SW42  Part Number: MX1A-E1NW  [SW_Cherry_MX_1.00u_PCB]  (hidden comment: Switch_Key_Switch_MX1A-E1NW_eec)
SW43  Part Number: MX1A-E1NW  [SW_Cherry_MX_2.00u_PCB]  (hidden comment: Switch_Key_Switch_MX1A-E1NW_eec)
SW44  Part Number: MX1A-E1NW  [SW_Cherry_MX_1.00u_PCB]  (hidden comment: Switch_Key_Switch_MX1A-E1NW_eec)
SW45  Part Number: MX1A-E1NW  [SW_Cherry_MX_2.00u_PCB]  (hidden comment: Switch_Key_Switch_MX1A-E1NW_eec)
SW46  Part Number: MX1A-E1NW  [SW_Cherry_MX_1.00u_PCB]  (hidden comment: Switch_Key_Switch_MX1A-E1NW_eec)
SW47  Part Number: MX1A-E1NW  [SW_Cherry_MX_1.00u_PCB]  (hidden comment: Switch_Key_Switch_MX1A-E1NW_eec)
SW48  Part Number: MX1A-E1NW  [SW_Cherry_MX_1.00u_PCB]  (hidden comment: Switch_Key_Switch_MX1A-E1NW_eec)
SW49  Part Number: MX1A-E1NW  [SW_Cherry_MX_1.00u_PCB]  (hidden comment: Switch_Key_Switch_MX1A-E1NW_eec)
SW50  Part Number: MX1A-E1NW  [SW_Cherry_MX_1.00u_PCB]  (hidden comment: Switch_Key_Switch_MX1A-E1NW_eec)
SW51  Part Number: MX1A-E1NW  [SW_Cherry_MX_1.00u_PCB]  (hidden comment: Switch_Key_Switch_MX1A-E1NW_eec)
SW52  Part Number: MX1A-E1NW  [SW_Cherry_MX_1.00u_PCB]  (hidden comment: Switch_Key_Switch_MX1A-E1NW_eec)
SW53  Part Number: MX1A-E1NW  [SW_Cherry_MX_1.00u_PCB]  (hidden comment: Switch_Key_Switch_MX1A-E1NW_eec)
SW54  Part Number: MX1A-E1NW  [SW_Cherry_MX_1.00u_PCB]  (hidden comment: Switch_Key_Switch_MX1A-E1NW_eec)
SW55  Part Number: MX1A-E1NW  [SW_Cherry_MX_1.00u_PCB]  (hidden comment: Switch_Key_Switch_MX1A-E1NW_eec)
SW56  Part Number: MX1A-E1NW  [SW_Cherry_MX_1.75u_PCB]  (hidden comment: Switch_Key_Switch_MX1A-E1NW_eec)
SW57  Part Number: MX1A-E1NW  [SW_Cherry_MX_1.00u_PCB]  (hidden comment: Switch_Key_Switch_MX1A-E1NW_eec)
SW58  Part Number: MX1A-E1NW  [SW_Cherry_MX_1.00u_PCB]  (hidden comment: Switch_Key_Switch_MX1A-E1NW_eec)
SW59  Part Number: MX1A-E1NW  [SW_Cherry_MX_1.50u_PCB]  (hidden comment: Switch_Key_Switch_MX1A-E1NW_eec)
SW60  Part Number: MX1A-E1NW  [SW_Cherry_MX_1.25u_PCB]  (hidden comment: Switch_Key_Switch_MX1A-E1NW_eec)
SW61  Part Number: MX1A-E1NW  [SW_Cherry_MX_1.50u_PCB]  (hidden comment: Switch_Key_Switch_MX1A-E1NW_eec)
SW62  Part Number: MX1A-E1NW  [SW_Cherry_MX_6.25u_PCB]  (hidden comment: Switch_Key_Switch_MX1A-E1NW_eec)
SW63  Part Number: MX1A-E1NW  [SW_Cherry_MX_1.25u_PCB]  (hidden comment: Switch_Key_Switch_MX1A-E1NW_eec)
SW64  Part Number: MX1A-E1NW  [SW_Cherry_MX_1.00u_PCB]  (hidden comment: Switch_Key_Switch_MX1A-E1NW_eec)
SW65  Part Number: MX1A-E1NW  [SW_Cherry_MX_1.00u_PCB]  (hidden comment: Switch_Key_Switch_MX1A-E1NW_eec)
SW66  Part Number: MX1A-E1NW  [SW_Cherry_MX_1.00u_PCB]  (hidden comment: Switch_Key_Switch_MX1A-E1NW_eec)
SW67  Part Number: MX1A-E1NW  [SW_Cherry_MX_1.00u_PCB]  (hidden comment: Switch_Key_Switch_MX1A-E1NW_eec)

### Ports
col 0, col 1, col 2, col 3, col 4, col 5, col 6, col 7, col 8, col 9, col 10, col 11, col 12, col 13, col 14, row 0, row 1, row 2, row 3, row 4

### Nets
NetD1_1: D1.1(C) D2.1(C) D3.1(C) D4.1(C) D5.1(C) D6.1(C) D7.1(C) D8.1(C) D9.1(C) D10.1(C) D11.1(C) D12.1(C) D13.1(C) D14.1(C) D15.1(C) ; port row 0
NetD1_2: D1.2(A) SW1.1
NetD2_2: D2.2(A) SW2.1
NetD3_2: D3.2(A) SW3.1
NetD4_2: D4.2(A) SW4.1
NetD5_2: D5.2(A) SW5.1
NetD6_2: D6.2(A) SW6.1
NetD7_2: D7.2(A) SW7.1
NetD8_2: D8.2(A) SW8.1
NetD9_2: D9.2(A) SW9.1
NetD10_2: D10.2(A) SW10.1
NetD11_2: D11.2(A) SW11.1
NetD12_2: D12.2(A) SW12.1
NetD13_2: D13.2(A) SW13.1
NetD14_2: D14.2(A) SW14.1
NetD15_2: D15.2(A) SW15.1
NetD16_1: D16.1(C) D17.1(C) D18.1(C) D19.1(C) D20.1(C) D21.1(C) D22.1(C) D23.1(C) D24.1(C) D25.1(C) D26.1(C) D27.1(C) D28.1(C) D29.1(C) D30.1(C) ; port row 1
NetD16_2: D16.2(A) SW16.1
NetD17_2: D17.2(A) SW17.1
NetD18_2: D18.2(A) SW18.1
NetD19_2: D19.2(A) SW19.1
NetD20_2: D20.2(A) SW20.1
NetD21_2: D21.2(A) SW21.1
NetD22_2: D22.2(A) SW22.1
NetD23_2: D23.2(A) SW23.1
NetD24_2: D24.2(A) SW24.1
NetD25_2: D25.2(A) SW25.1
NetD26_2: D26.2(A) SW26.1
NetD27_2: D27.2(A) SW27.1
NetD28_2: D28.2(A) SW28.1
NetD29_2: D29.2(A) SW29.1
NetD30_2: D30.2(A) SW30.1
NetD31_1: D31.1(C) D32.1(C) D33.1(C) D34.1(C) D35.1(C) D36.1(C) D37.1(C) D38.1(C) D39.1(C) D40.1(C) D41.1(C) D42.1(C) D43.1(C) D44.1(C) ; port row 2
NetD31_2: D31.2(A) SW31.1
NetD32_2: D32.2(A) SW32.1
NetD33_2: D33.2(A) SW33.1
NetD34_2: D34.2(A) SW34.1
NetD35_2: D35.2(A) SW35.1
NetD36_2: D36.2(A) SW36.1
NetD37_2: D37.2(A) SW37.1
NetD38_2: D38.2(A) SW38.1
NetD39_2: D39.2(A) SW39.1
NetD40_2: D40.2(A) SW40.1
NetD41_2: D41.2(A) SW41.1
NetD42_2: D42.2(A) SW42.1
NetD43_2: D43.2(A) SW43.1
NetD44_2: D44.2(A) SW44.1
NetD45_1: D45.1(C) D46.1(C) D47.1(C) D48.1(C) D49.1(C) D50.1(C) D51.1(C) D52.1(C) D53.1(C) D54.1(C) D55.1(C) D56.1(C) D57.1(C) D58.1(C) ; port row 3
NetD45_2: D45.2(A) SW45.1
NetD46_2: D46.2(A) SW46.1
NetD47_2: D47.2(A) SW47.1
NetD48_2: D48.2(A) SW48.1
NetD49_2: D49.2(A) SW49.1
NetD50_2: D50.2(A) SW50.1
NetD51_2: D51.2(A) SW51.1
NetD52_2: D52.2(A) SW52.1
NetD53_2: D53.2(A) SW53.1
NetD54_2: D54.2(A) SW54.1
NetD55_2: D55.2(A) SW55.1
NetD56_2: D56.2(A) SW56.1
NetD57_2: D57.2(A) SW57.1
NetD58_2: D58.2(A) SW58.1
NetD59_1: D59.1(C) D60.1(C) D61.1(C) D62.1(C) D63.1(C) D64.1(C) D65.1(C) D66.1(C) D67.1(C) ; port row 4
NetD59_2: D59.2(A) SW59.1
NetD60_2: D60.2(A) SW60.1
NetD61_2: D61.2(A) SW61.1
NetD62_2: D62.2(A) SW62.1
NetD63_2: D63.2(A) SW63.1
NetD64_2: D64.2(A) SW64.1
NetD65_2: D65.2(A) SW65.1
NetD66_2: D66.2(A) SW66.1
NetD67_2: D67.2(A) SW67.1
NetSW1_2: SW1.2 SW16.2 SW31.2 SW45.2 SW59.2 ; port col 0
NetSW2_2: SW2.2 SW17.2 SW32.2 SW46.2 SW60.2 ; port col 1
NetSW3_2: SW3.2 SW18.2 SW33.2 SW47.2 SW61.2 ; port col 2
NetSW4_2: SW4.2 SW19.2 SW34.2 SW48.2 ; port col 3
NetSW5_2: SW5.2 SW20.2 SW35.2 SW49.2 ; port col 4
NetSW6_2: SW6.2 SW21.2 SW36.2 SW50.2 ; port col 5
NetSW7_2: SW7.2 SW22.2 SW37.2 SW51.2 SW62.2 ; port col 6
NetSW8_2: SW8.2 SW23.2 SW38.2 SW52.2 ; port col 7
NetSW9_2: SW9.2 SW24.2 SW39.2 SW53.2 ; port col 8
NetSW10_2: SW10.2 SW25.2 SW40.2 SW54.2 ; port col 9
NetSW11_2: SW11.2 SW26.2 SW41.2 SW55.2 SW63.2 ; port col 10
NetSW12_2: SW12.2 SW27.2 SW42.2 SW64.2 ; port col 11
NetSW13_2: SW13.2 SW28.2 SW56.2 SW65.2 ; port col 12
NetSW14_2: SW14.2 SW29.2 SW43.2 SW57.2 SW66.2 ; port col 13
NetSW15_2: SW15.2 SW30.2 SW44.2 SW58.2 SW67.2 ; port col 14

### Library data of the parts
D1-D67 = CMP-2000-04993-2: DIODE GEN PURP 100V 150MA SOD123; Max Reverse Leakage Current: 5uA; Max Surge Current: 2A; Reverse Recovery Time: 4ns; Polarity: Standard; Capacitance: 4pF; Max Forward Surge Current (Ifsm): 1A; Element Configuration: Single; Power Dissipation: 400mW; Forward Voltage: 1V; Radiation Hardening: No; Lead Free: Lead Free; Max Reverse Voltage (DC): 100V; Current Rating: 150mA; Forward Current: 150mA; Packaging: Tape and Reel; Number of Pins: 2; Package Quantity: 3000; Max Operating Temperature: 150°C; Min Operating Temperature: -65°C; Average Rectified Current: 150mA; Recovery Time: 4ns; Output Current: 150mA; Peak Non-Repetitive Surge Current: 2A; Width: 1.8mm; Voltage Rating (DC): 100V; Height: 1.2mm; Max Repetitive Reverse Voltage (Vrrm): 100V; Mount: Surface Mount; Length: 2.85mm
SW1-SW67 = Switch_Key_Switch_MX1A-E1NW_eec: SWITCH PUSH SPST-NO 0.01A 12V; Manufacturer: Key Switch; Category 8Ce341E9Bf4C5724: Switches; size_length: 15.6 mm; contact_current_rating: 10 mA; Category Db391633E8F300Fe: Industrial Control; Category 6A0Ba70159B8B1Cc: Keylock; contact_plating: Gold; Category A9A064Aa9A0A7267: Tactile / Jog; contacts_type: SPST; Category 2Bfae6F01857F03D: Pushbutton; Num Pins: 2; Category 6E88A3825D3Cb54F: Uncategorized; helpURL: https://upverter.com/upn/revision/8244d7a80b28a9e1/; ComponentLink2Description: Datasheet; Temperature: -10°C to +70°C; Package: MX1A; Supplier 2: Mouser; Price: 0.741007758432; Supplier 1: Digi-Key; ComponentLink1URL: https://upverter.com/upn/revision/8244d7a80b28a9e1/; Supplier Part Number 2: 540-MX1A-E1NW; Supplier Part Number 1: CH197-ND; Voltage: 12V; ComponentLink1Description: Upverter; ComponentLink2URL: https://upverter.com/datasheet/a174b925b05052267a652262a41f429ea7a87855.pdf; RoHS: TRUE; Mouser Part Number: 540-MX1A-E1NW; orientation: Vertical; Temperature Range High: +70°C; Digikey Description: SWITCH PUSH SPST-NO 0.01A 12V; Digikey Part Number: CH197-ND; Lead Free: yes; Temperature Range Low: -10°C; Mounting Type: lug; size_width: 15.6 mm

## Nets that join several sheets
NetD1_1: Sheet1 (U1.1), switch matrix (15 pins)
NetD16_1: Sheet1 (U1.38), switch matrix (15 pins)
NetD31_1: Sheet1 (U1.41), switch matrix (14 pins)
NetD45_1: Sheet1 (U1.40), switch matrix (14 pins)
NetD59_1: Sheet1 (U1.39), switch matrix (9 pins)
NetSW1_2: Sheet1 (U1.28), switch matrix (5 pins)
NetSW2_2: Sheet1 (U1.29), switch matrix (5 pins)
NetSW3_2: Sheet1 (U1.30), switch matrix (5 pins)
NetSW4_2: Sheet1 (U1.31), switch matrix (SW4.2 SW19.2 SW34.2 SW48.2)
NetSW5_2: Sheet1 (U1.32), switch matrix (SW5.2 SW20.2 SW35.2 SW49.2)
NetSW6_2: Sheet1 (U1.37), switch matrix (SW6.2 SW21.2 SW36.2 SW50.2)
NetSW7_2: Sheet1 (U1.36), switch matrix (5 pins)
NetSW8_2: Sheet1 (U1.8), switch matrix (SW8.2 SW23.2 SW38.2 SW52.2)
NetSW9_2: Sheet1 (U1.19), switch matrix (SW9.2 SW24.2 SW39.2 SW53.2)
NetSW10_2: Sheet1 (U1.20), switch matrix (SW10.2 SW25.2 SW40.2 SW54.2)
NetSW11_2: Sheet1 (U1.21), switch matrix (5 pins)
NetSW12_2: Sheet1 (U1.25), switch matrix (SW12.2 SW27.2 SW42.2 SW64.2)
NetSW13_2: Sheet1 (U1.22), switch matrix (SW13.2 SW28.2 SW56.2 SW65.2)
NetSW14_2: Sheet1 (U1.26), switch matrix (5 pins)
NetSW15_2: Sheet1 (U1.27), switch matrix (5 pins)